# EAGLE design adm823 Breakout Board (EAGLE 9.6.2)
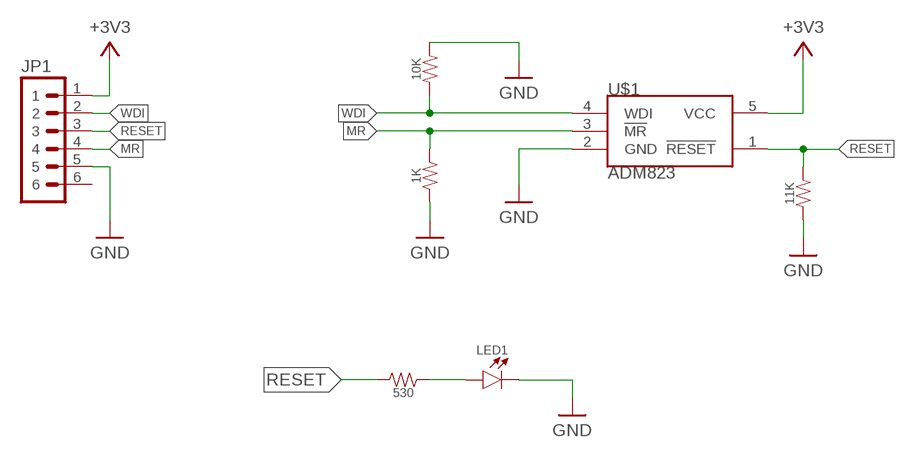
[diagram p0: schematic, sheet 1]

## Parts
1K  RESISTOR_0603_  [0603-RES]
10K  10k  RESISTOR_0603_  [0603-RES]
11K  10k  RESISTOR_0603_  [0603-RES]
530  RESISTOR_0603_  [0603-RES]
JP1  M06  [1X06]
LED1  LED-0603  [LED-603]
U$1  ADM823  [SOT323-5]

## Nets
+3V3: JP1.1 U$1.5(VCC)
GND: 1K.1 10K.2 11K.1 JP1.5 LED1.C U$1.2(GND)
MR: 1K.2 JP1.4 U$1.3(!MR!)
N$1: 530.1 LED1.A
RESET: 11K.2 530.2 JP1.3 U$1.1(!RESET!)
WDI: 10K.1 JP1.2 U$1.4(WDI)
Unconnected: JP1.6

## Library data of the parts
1K 10K 11K 530 = HyTechDevices:RESISTOR_?_*: Resistor Basic schematic elements and footprints for 0603, 1206, and PTH resistors.
JP1 = HyTechDevices:M06: Standard 6-pin 0.1" header. NOTES ON THE VARIANTS LOCK and LOCK_LONGPADS... This footprint was designed to help hold the alignment of a through-hole component (i.e. 6-pin header) while soldering it into place. You may notice that each hole has been shifted either up or down by 0.005 of an inch from it's more standard position (which is a perfectly straight line). This slight alteration caused the pins (the squares in the middle) to touch the edges of the holes. Because they are alternating, it causes a "brace" to hold the component in place. 0.005 has proven to be the perfect amount of "off-center" position when using our standard breakaway headers. Although looks a little odd when you look at the bare footprint, once you have a header in there, the alteration is very hard to notice. Also,if you push a header all the way into place, it is covered up entirely on the bottom side. This idea of altering the position of holes to aid alignment will be further integrated into the Sparkfun Library for other footprints. It can help hold any component with 3 or more connection pins. Note: The Sparkfun version includes many other packages including surface mount that may be of future interest. Source: Sparkfun <https://github.com/sparkfun/SparkFun-Eagle-Libraries>
LED1 = HyTechDevices:LED: Light Emitting Diode (LED) Source: Dangerous Prototypes Eagle Library <https://github.com/DangerousPrototypes/Eagle_Part_Library>
U$1 = HyTechDevices:ADM823: ADM823 Watchdog Timer Datasheet <https://www.analog.com/media/en/technical-documentation/data-sheets/ADM823_824_825.pdf>

## Board
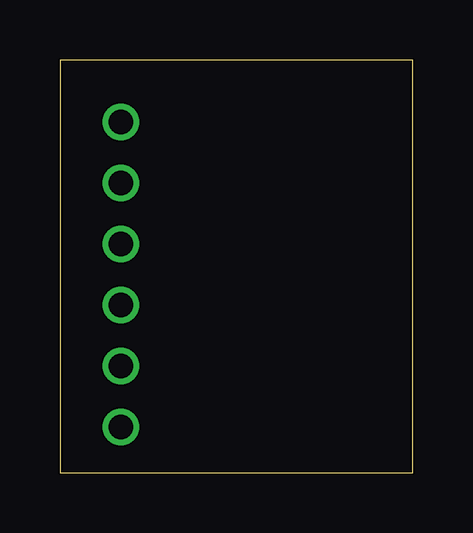
[diagram p1: board, top side]
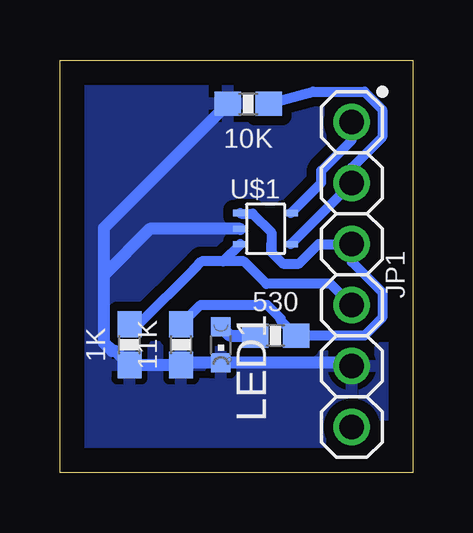
[diagram p2: board, bottom side, seen from below]

Size 14.71 x 17.2 mm. Coordinates in mm from the lower left corner, seen from the top.
Outline: 0,0 14.71,0 14.71,17.2 0,17.2 0,0
Copper layers 16: Bottom 0.035mm
Design rules "On Campus (1 Layer)": minimum track width 16mil, minimum drill 0.8mm, track to track 16mil, track to pad 12mil, pad to pad 16mil, via to via 16mil, smd to smd 10mil, copper to edge 40mil, drill to drill 10mil, minimum pad ring 10mil, minimum via ring 8mil, stop-mask expansion 4mil, vias tented up to drill 0mil, thermal gap 10mil

### Footprints (pad centres in the part's own frame; a part is rotated, then mirrored left to right if it is on the bottom)
0603-RES = smd 1.1 x 1: 1 -0.85,0; 2 0.85,0
1X06 = drill 1.016: 1 -6.35,0; 2 -3.81,0; 3 -1.27,0; 4 1.27,0; 5 3.81,0; 6 6.35,0
LED-603 = smd 0.8 x 0.8: A 0,-0.75; C 0,0.75
SOT323-5 = smd 0.61 x 0.254: 1 -2.108,1.295; 2 -2.108,0.635; 3 -2.108,0; 4 0,0; 5 0,1.295

### Placement (x,y rotation side)
1K  11.81,5.33 90 bottom
10K  6.86,15.37 180 bottom
11K  9.65,5.33 90 bottom
530  5.71,5.71 0 bottom
JP1  2.54,8.26 270 bottom
LED1  8,5.33 180 bottom
U$1  5.08,9.53 0 bottom

### Tracks (layer width: path | path; a pad name or v marks a point on that pad's centre or on a via)
+3V3
  Bottom 0.406: U$1.5 3.81,12.09 3.81,12.59 2.54,13.86 JP1.1
GND
  Bottom 0.508: JP1.5 2.68,4.58 LED1.C 9.55,4.58 11K.1 1K.1 12.4,5.08 12.54,5.08 12.87,5.4 12.87,8.26 | 12.87,8.26 12.87,10.21 11.22,11.86 10K.2 | U$1.2 10.96,10.16 12.87,8.26
  pour Bottom: 0,17.14 0,0 14.61,0 14.73,0.13 14.73,17.02 14.61,17.14
MR
  Bottom 0.406: 1K.2 11.42,6.18 9.12,8.48 8.8,8.81 | JP1.4 3.42,7.87 6.1,7.87 7.04,8.81 8.8,8.81 | U$1.3 7.91,8.81 8.8,8.81
N$1
  Bottom 0.508: LED1.A 7.63,5.71 530.1
RESET
  Bottom 0.406: U$1.1 7.16,10.79 6.67,10.79 5.89,10.02 5.89,9.53 | 5.89,9.19 5.89,9.53 | 5.89,9.53 5.89,9.19 | 5.89,9.19 5.42,8.71 4.74,8.71 3.93,9.53 JP1.3 2.54,8.78 1.27,7.51 1.27,6.46 2.01,5.71 3.07,5.71 530.2 5.51,6.36 5.51,6.42 6.07,6.99 8.84,6.99 11K.2
WDI
  Bottom 0.406: U$1.4 JP1.2 2.54,12.71 1.27,13.98 1.27,15.13 2.01,15.88 4.15,15.88 10K.1